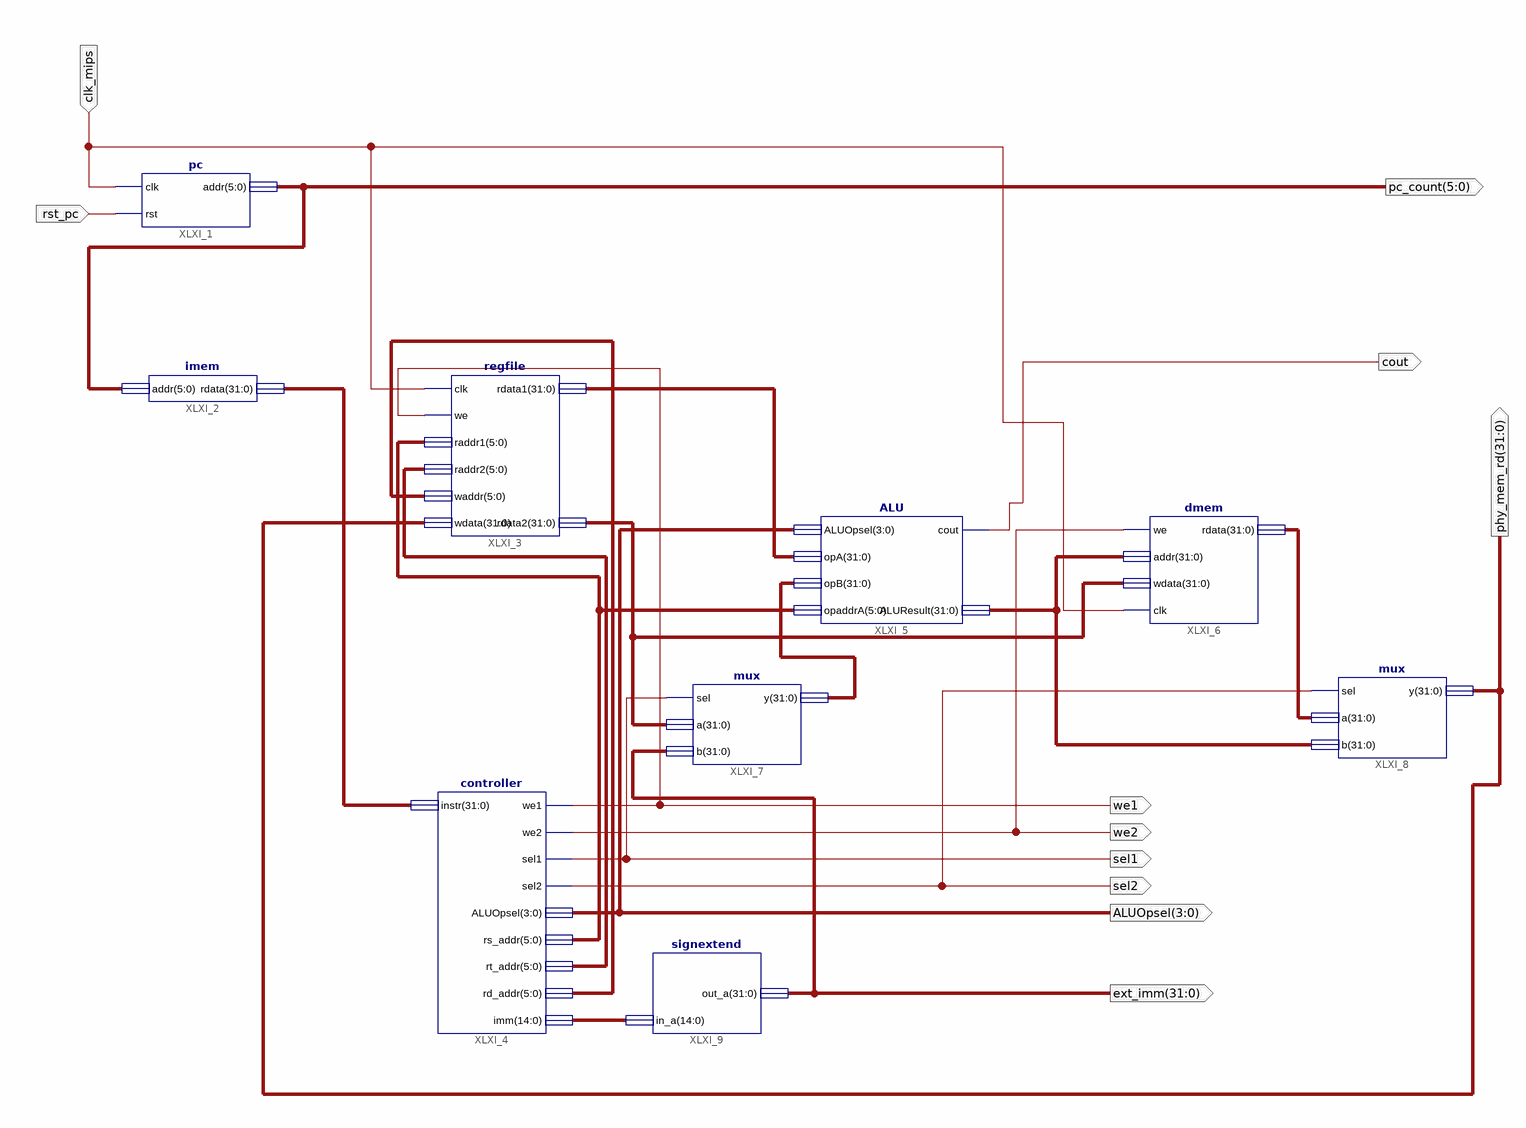
[diagram p0: schematic sheet 1]
// Xilinx ISE schematic top_MIPS.sch (spartan3a) as structural Verilog: 9 symbols, 11 ports
module top_MIPS (
  input  clk_mips,
  input  rst_pc,
  output [5:0] pc_count,
  output [3:0] ALUOpsel,
  output sel1,
  output [31:0] ext_imm,
  output sel2,
  output [31:0] phy_mem_rd,
  output we1,
  output we2,
  output cout
);

  wire [5:0] XLXN_5, XLXN_6, XLXN_7;
  wire [14:0] XLXN_17;
  wire [31:0] XLXN_3, XLXN_9, XLXN_13, XLXN_15, XLXN_22, XLXN_31;

  pc XLXI_1 (.clk(clk_mips), .rst(rst_pc), .addr(pc_count));
  imem XLXI_2 (.addr(pc_count), .rdata(XLXN_3));
  regfile XLXI_3 (
    .clk(clk_mips), .we(we1), .raddr1(XLXN_7), .raddr2(XLXN_6), .waddr(XLXN_5), .wdata(phy_mem_rd),
    .rdata1(XLXN_9), .rdata2(XLXN_13));
  controller XLXI_4 (
    .instr(XLXN_3), .we1(we1), .we2(we2), .sel1(sel1), .sel2(sel2), .ALUOpsel(ALUOpsel), .rs_addr(XLXN_7),
    .rt_addr(XLXN_6), .rd_addr(XLXN_5), .imm(XLXN_17));
  ALU XLXI_5 (.ALUOpsel(ALUOpsel), .opA(XLXN_9), .opB(XLXN_15), .opaddrA(XLXN_7), .cout(cout), .ALUResult(XLXN_22));
  dmem XLXI_6 (.clk(clk_mips), .we(we2), .addr(XLXN_22), .wdata(XLXN_13), .rdata(XLXN_31));
  mux XLXI_7 (.sel(sel1), .a(XLXN_13), .b(ext_imm), .y(XLXN_15));
  mux XLXI_8 (.sel(sel2), .a(XLXN_31), .b(XLXN_22), .y(phy_mem_rd));
  signextend XLXI_9 (.in_a(XLXN_17), .out_a(ext_imm));
endmodule
